# EAGLE design dps (EAGLE 6.3)
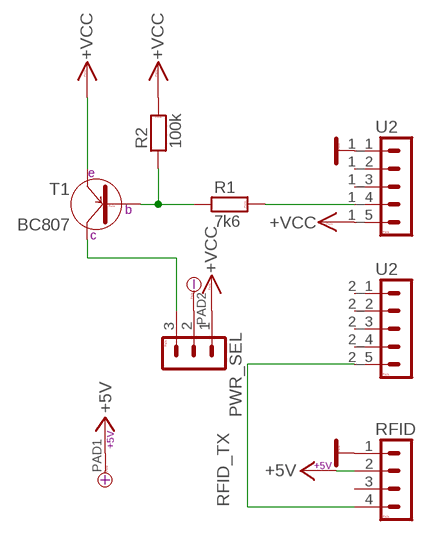
[diagram p0: schematic, sheet 1]

## Parts
PAD1  +  PAD_1+  [PAD_1]
PAD2  -  PAD_1-  [PAD_1]
PWR_SEL  S1G3_JUMP  [S1G3_JUM]
R1  7k6  R_SMD_1206  [1206]
R2  100k  R_SMD_1206  [1206]
RFID  S1G4_JUMP  [S1G4_JUM]
T1  BC807  [SOT-23]
U2  S2G5_JUMP  [S2G5_JUM]

## Nets
+5V: PAD1.1(+) RFID.2
GND: RFID.1 U2.1_1
N$1: PAD2.1(-) PWR_SEL.2
N$2: R1.1 R2.1 T1.1(B)
N$3: R1.2 U2.1_4
N$4: PWR_SEL.3 T1.3(C)
RFID_TX: RFID.4 U2.2_5
VCC: PWR_SEL.1 R2.2 T1.2(E) U2.1_5 ; supply symbol labelled +VCC
Unconnected: RFID.3 U2.1_2 U2.1_3 U2.2_1 U2.2_2 U2.2_3 U2.2_4

## Library data of the parts
PAD1 = #PaJa_22:PAD_1+: Pajeci bod - 2,54 mm prumer, + kladny
PAD2 = #PaJa_22:PAD_1-: Pajeci bod - 2,54 mm prumer, - zaporny
PWR_SEL = #PaJa_22:S1G3_JUMP: Radove konektory - koliky - 3x
R1 R2 = #PaJa_22:R: Rezistor
RFID = #PaJa_22:S1G4_JUMP: Radove konektory - koliky - 4x
T1 = #PaJa_22:BC807: SMD tranzistor - PNP - ekv. BC327
U2 = #PaJa_22:S2G5_JUMP: Radove konektory - koliky - dvojite - 2x5

## Board
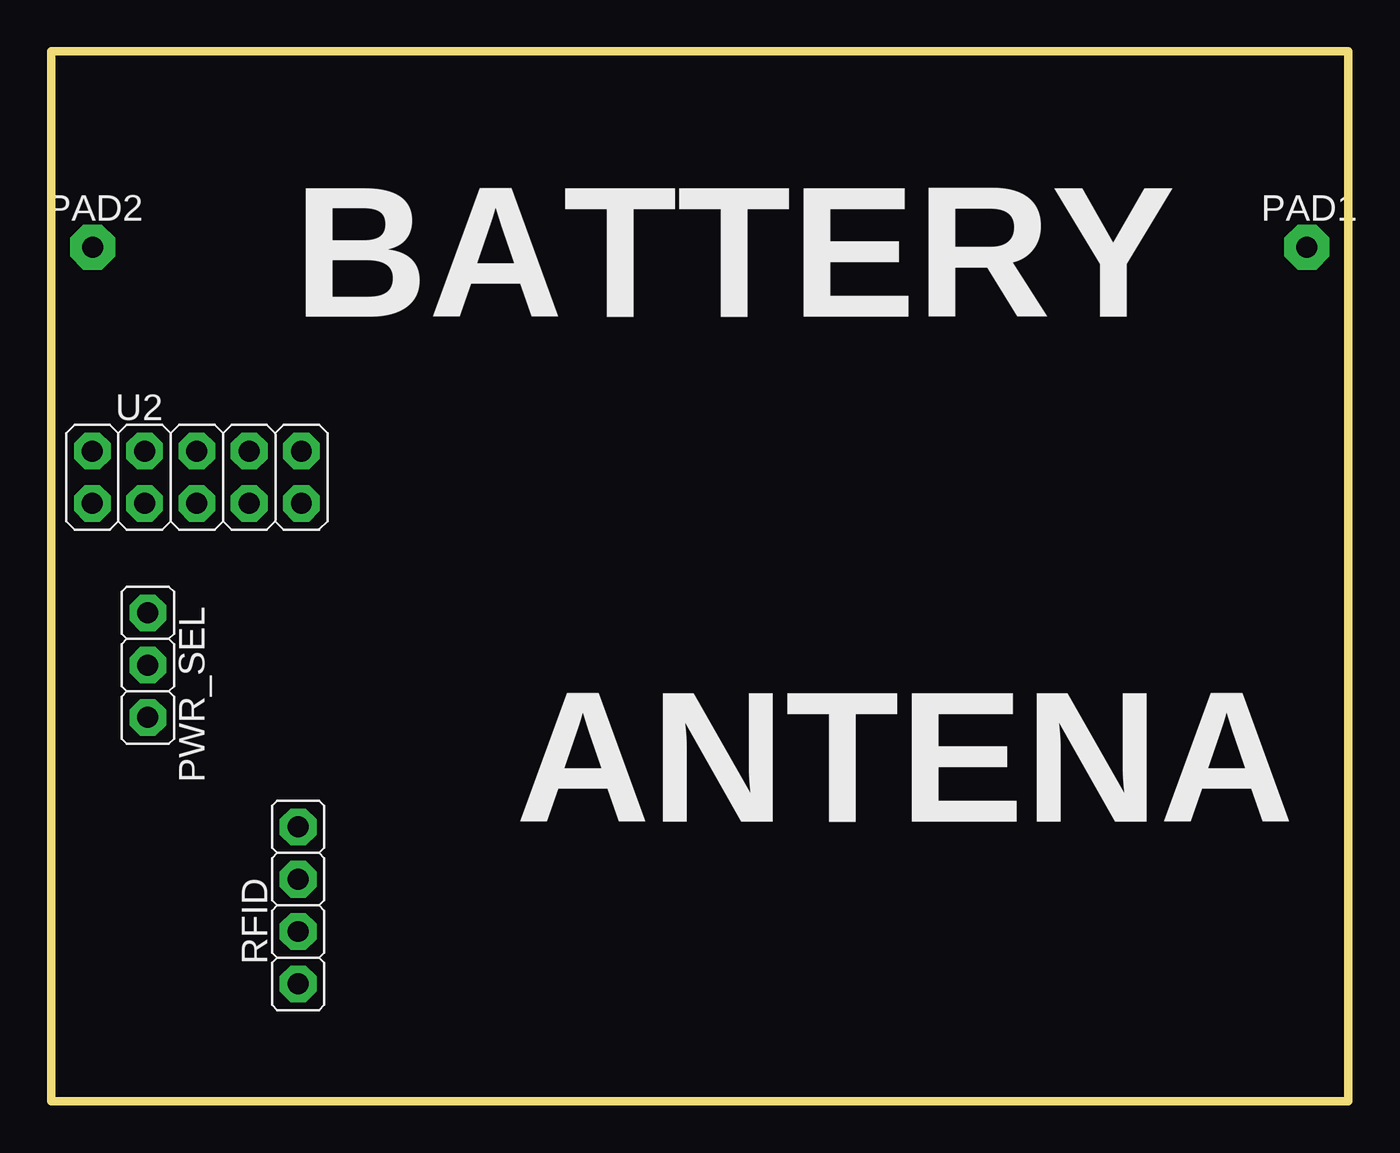
[diagram p1: board, top side]
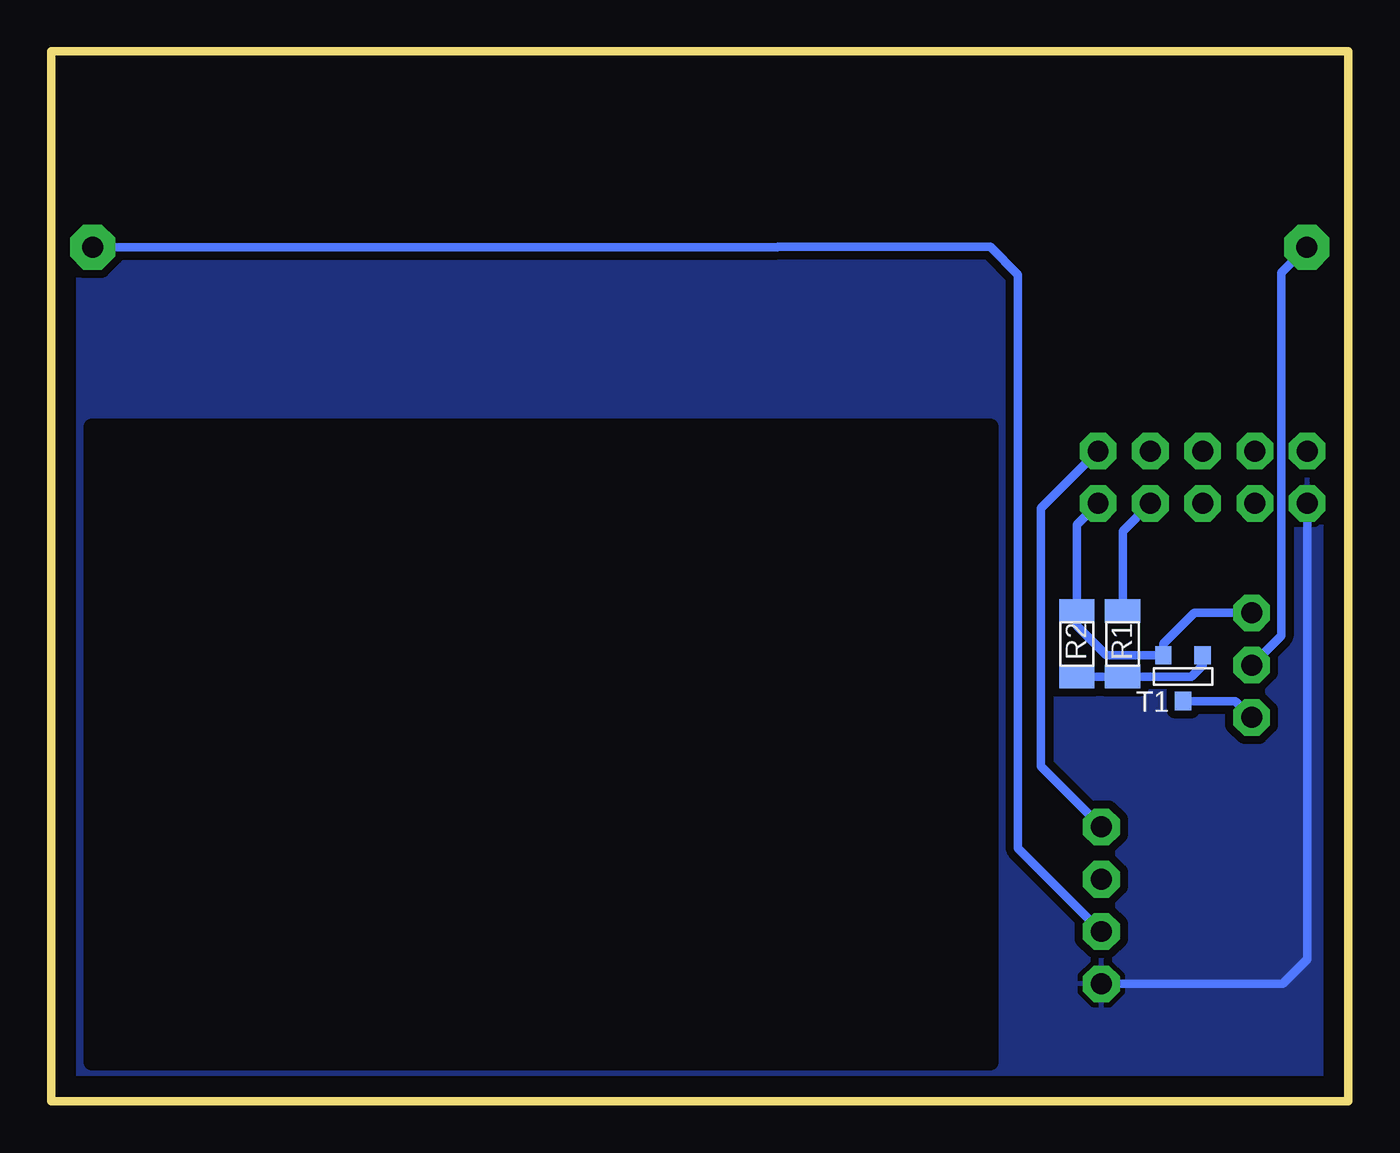
[diagram p2: board, bottom side, seen from below]

Size 63 x 51 mm. Coordinates in mm from the lower left corner, seen from the top.
Outline: 0,0 63,0 63,51 0,51 0,0
Copper layers (1*16): Top 0.035mm / dielectric 1.5mm / Bottom 0.035mm
Design rules "default": minimum track width 10mil, minimum drill 24mil, track to track 8mil, track to pad 8mil, pad to pad 8mil, via to via 8mil, smd to smd 8mil, copper to edge 40mil, drill to drill 8mil, minimum pad ring 10mil, minimum via ring 8mil, stop-mask expansion 4mil, vias tented up to drill 0mil, thermal gap 10mil
bRestrict: area 17.4,1.9 to 61,32.8

### Footprints (pad centres in the part's own frame; a part is rotated, then mirrored left to right if it is on the bottom)
PAD_1 = drill 1.016 pad 2.184 octagon: 1 0,0
S1G3_JUM = drill 1.016 pad 1.778 octagon: 1 -2.54,0; 2 0,0; 3 2.54,0
1206 = smd 1.143 x 1.702: 1 -1.587,0; 2 1.587,0
S1G4_JUM = drill 1.016 pad 1.778 octagon: 1 -3.81,0; 2 -1.27,0; 3 1.27,0; 4 3.81,0
SOT-23 = smd 0.787 x 0.889: 1 -0.953,-0.953; 2 0.953,-0.953; 3 0,1.27
S2G5_JUM = drill 1.016 pad 1.778 octagon: 1_1 -5.08,-1.27; 1_2 -2.54,-1.27; 1_3 0,-1.27; 1_4 2.54,-1.27; 1_5 5.08,-1.27; 2_1 -5.08,1.27; 2_2 -2.54,1.27; 2_3 0,1.27; 2_4 2.54,1.27; 2_5 5.08,1.27

### Placement (x,y rotation side)
PAD1  61,41.5 0 top
PAD2  2,41.5 0 top
PWR_SEL  4.68,21.19 270 top
R1  10.95,22.23 90 bottom
R2  13.18,22.23 90 bottom
RFID  11.99,9.53 90 top
T1  8.02,20.72 180 bottom
U2  7.06,30.32 0 top

### Tracks (layer width: path | path; a pad name or v marks a point on that pad's centre or on a via)
+5V
  Bottom 0.406: PAD1.1 27.71,41.5 27.7,41.51 17.38,41.51 16.03,40.16 16.03,12.3 RFID.2
GND
  Bottom 0.406: U2.1_1 1.98,6.91 3.17,5.71 RFID.1
  pour Bottom (isolate 0.406): -0.08,51.04 63.02,51.04 63.02,-0.08 -0.08,-0.08
N$1
  Bottom 0.406: PWR_SEL.2 3.25,22.62 3.25,40.25 PAD2.1
N$2
  Bottom 0.406: T1.1 7.06,21.19 7.62,20.64 R1.1 R2.1
N$3
  Bottom 0.406: R1.2 10.95,27.7 U2.1_4
N$4
  Bottom 0.406: T1.3 5.48,19.45 PWR_SEL.3
RFID_TX
  Bottom 0.406: U2.2_5 14.92,28.81 14.92,16.27 RFID.4
VCC
  Bottom 0.406: PWR_SEL.1 7.46,23.73 8.97,22.23 T1.2 11.75,21.67 13.18,23.1 R2.2 13.18,28.02 U2.1_5

### Text on the board
tNames: BATTERY | ANTENA